# Altium project USB_CPLD.PRJPCB
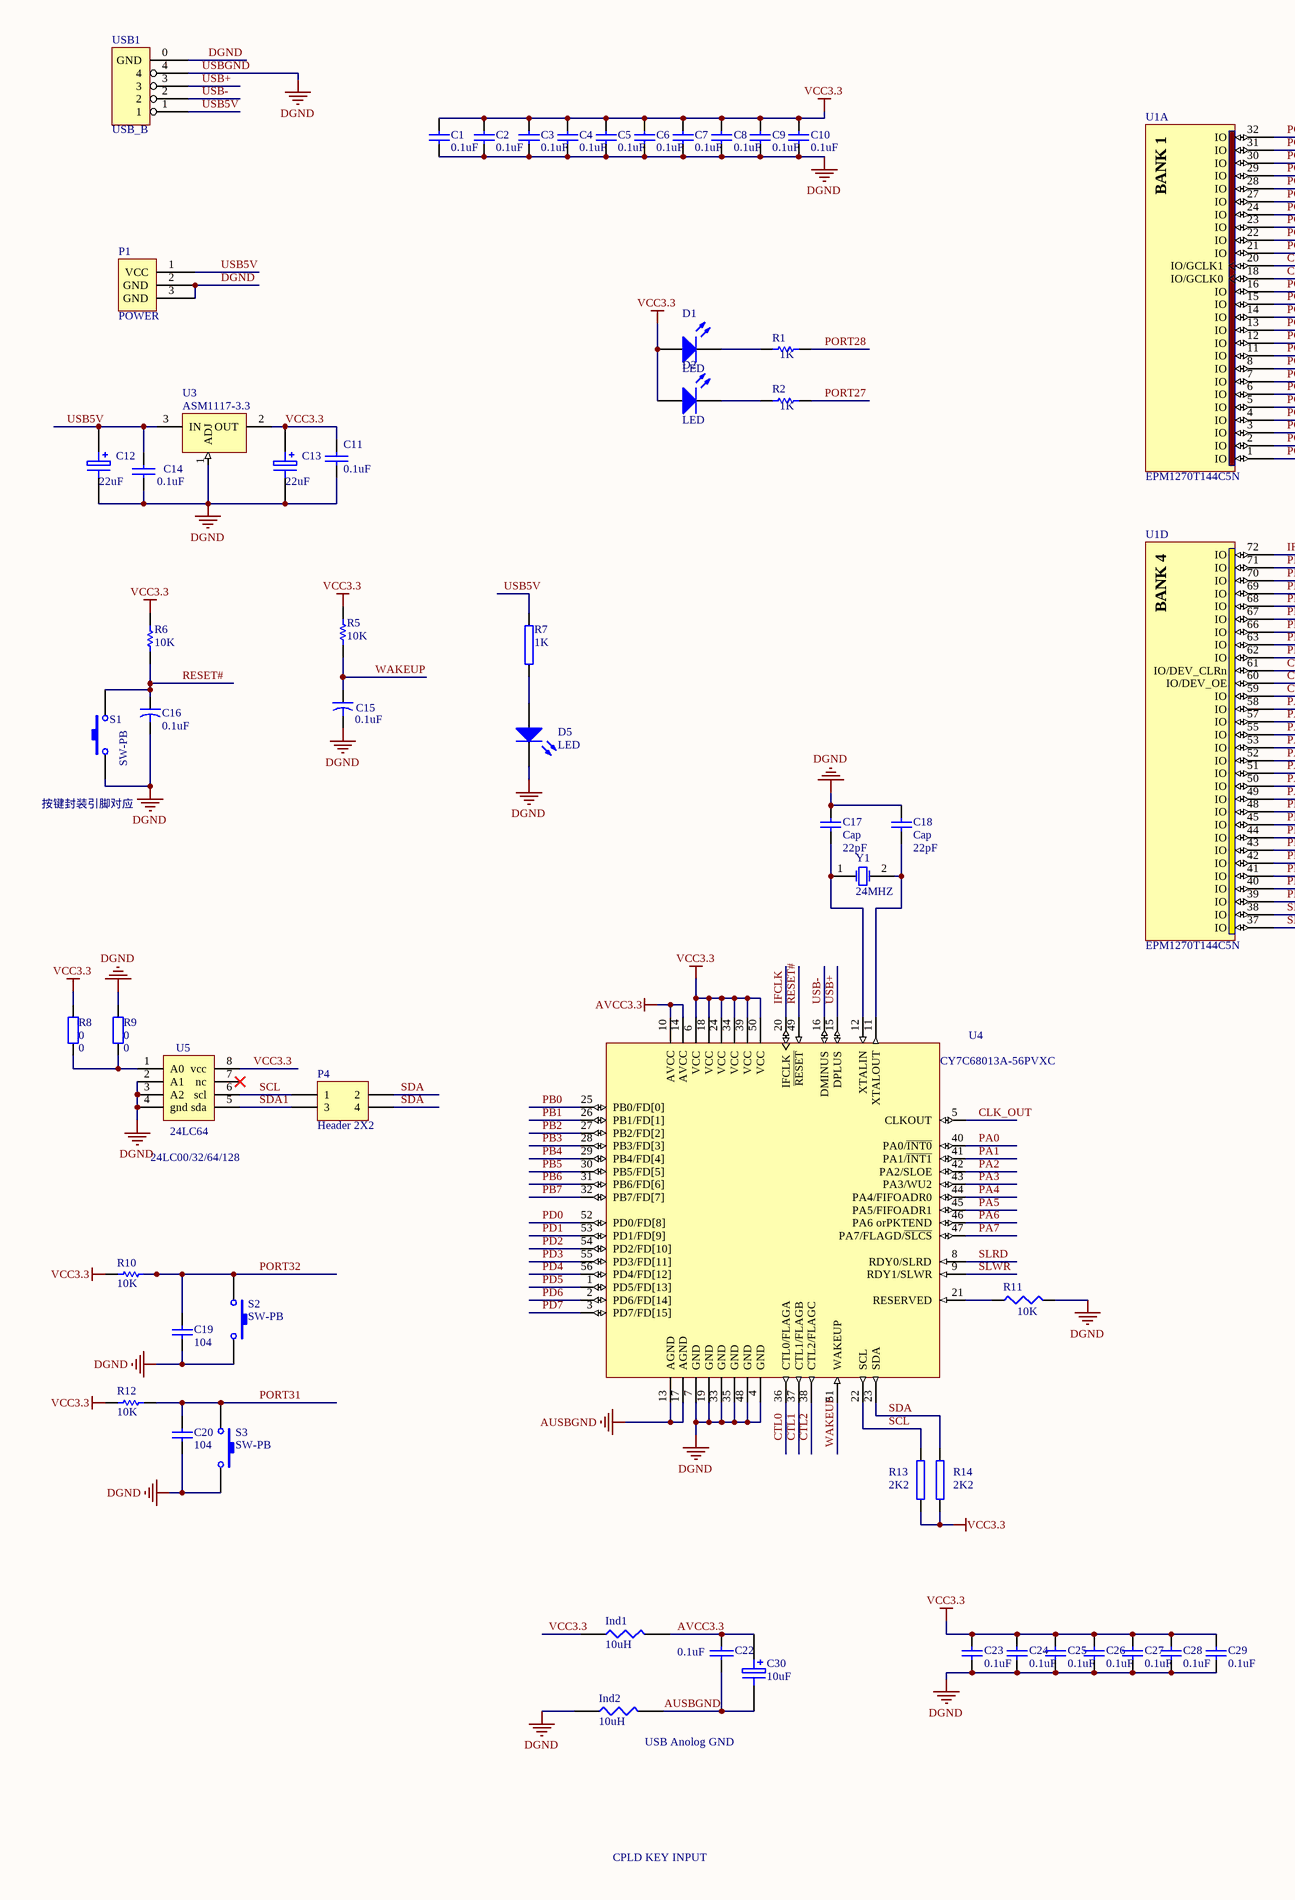
[diagram p0: USB_CPLD.SchDoc, left]
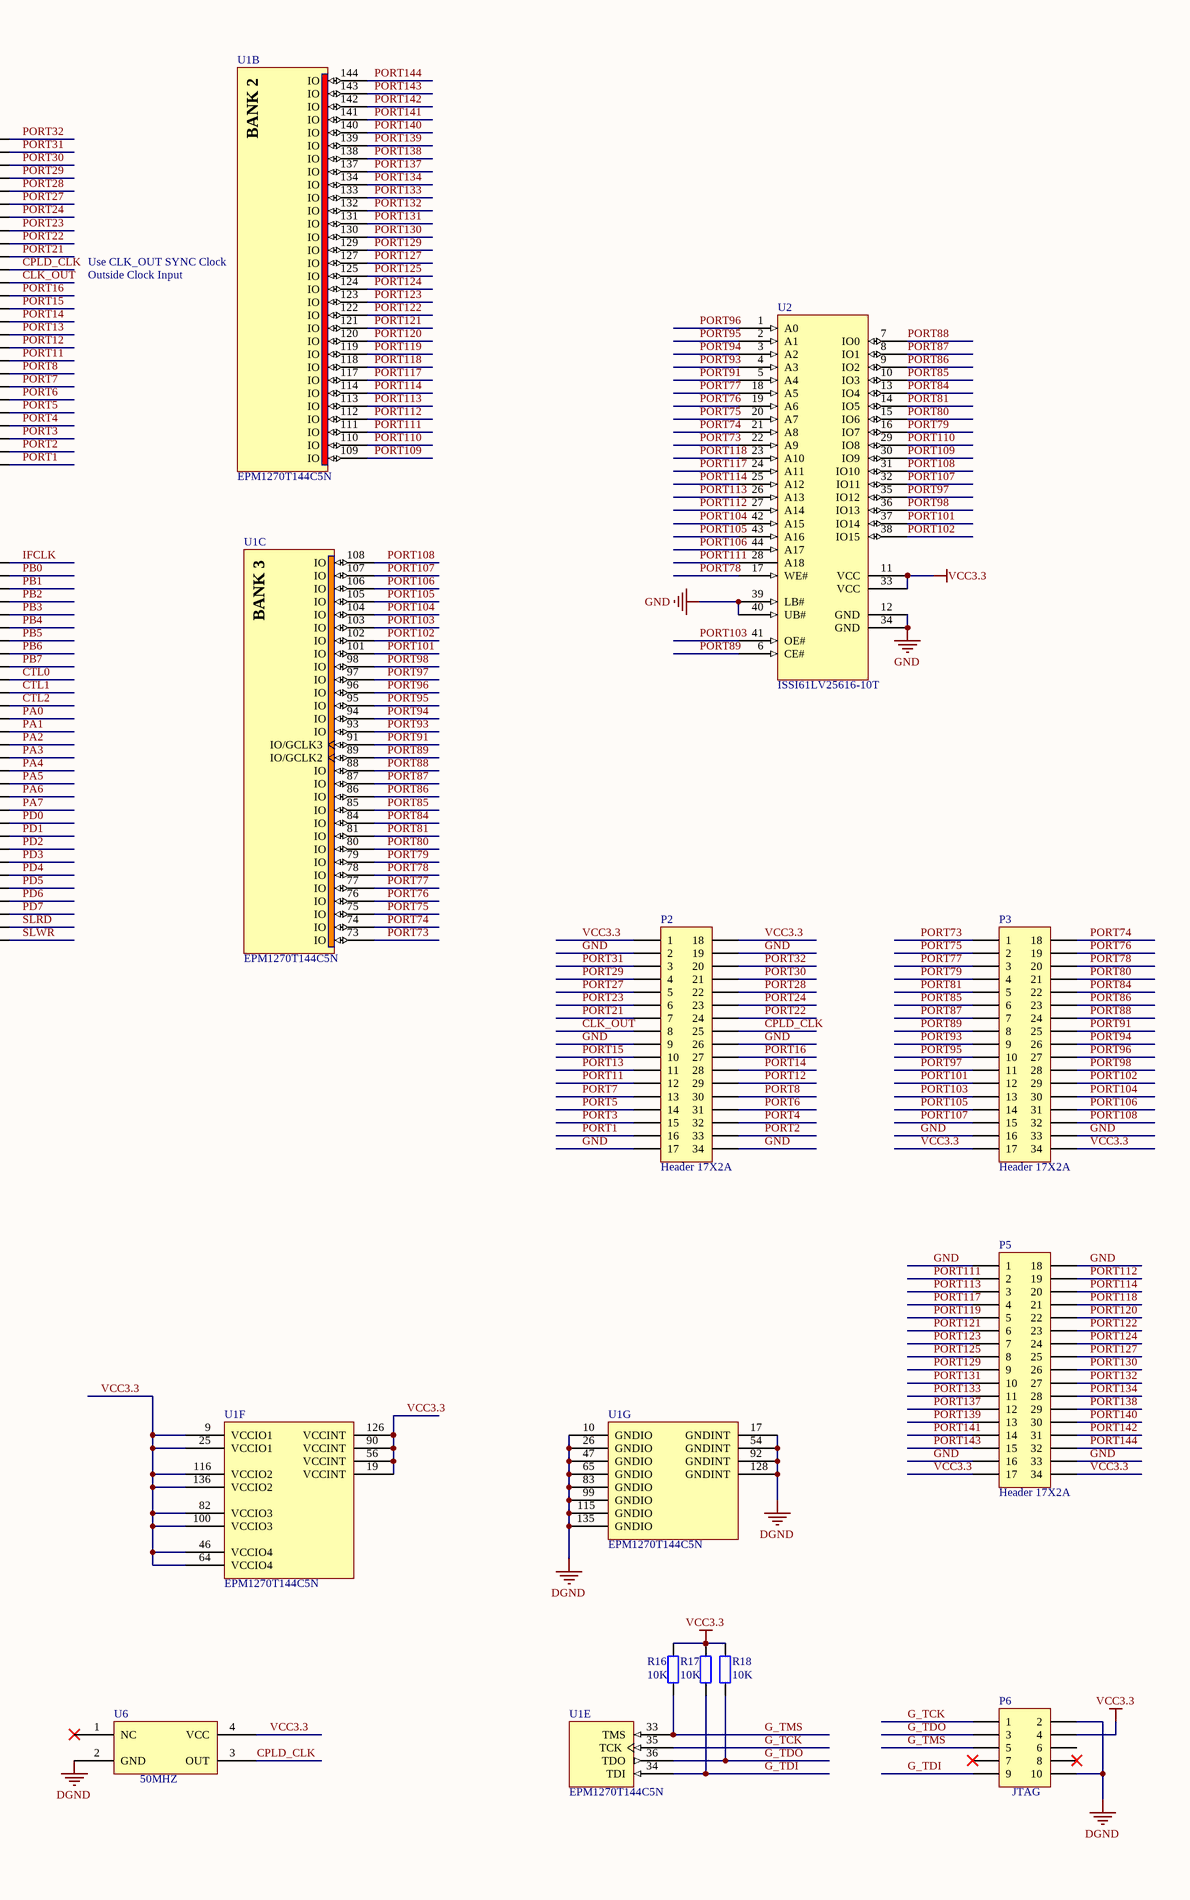
[diagram p1: USB_CPLD.SchDoc, right]
1 sheet, 66 parts. Net scope: global (net labels, ports and power ports of the same name join across sheets).
Board file: USB_CPLD.PcbDoc

## Sheet USB_CPLD.SchDoc: PC-104 16 bit bus
size C; Organization: Organization; Address1: Address1; Address2: Address2; Address3: Address3; Address4: Address4; DocumentNumber: 1; Revision: 0; SheetNumber: 2; SheetTotal: 2

### Parts
C1  0.1uF  [1608[0603]]
C2  0.1uF  [1608[0603]]
C3  value 0.1uF  [1608[0603]]  (hidden comment: Cap Semi)
C4  value 0.1uF  [1608[0603]]  (hidden comment: Cap Semi)
C5  value 0.1uF  [1608[0603]]  (hidden comment: Cap Semi)
C6  value 0.1uF  [1608[0603]]  (hidden comment: Cap Semi)
C7  value 0.1uF  [1608[0603]]  (hidden comment: Cap Semi)
C8  value 0.1uF  [1608[0603]]  (hidden comment: Cap Semi)
C9  value 0.1uF  [1608[0603]]  (hidden comment: Cap Semi)
C10  value 0.1uF  [1608[0603]]  (hidden comment: Cap Semi)
C11  0.1uF  [1608[0603]]
C12  22uF  [3528]
C13  22uF  [3528]
C14  0.1uF  [1608[0603]]
C15  0.1uF  [1206]
C16  0.1uF  [1206]
C17  Cap  value 22pF  [1608[0603]]
C18  Cap  value 22pF  [1608[0603]]
C19  104  [1608[0603]]
C20  104  [1608[0603]]
C22  0.1uF  [1608[0603]]
C23  value 0.1uF  [1608[0603]]  (hidden comment: Cap Semi)
C24  value 0.1uF  [1608[0603]]  (hidden comment: Cap Semi)
C25  value 0.1uF  [1608[0603]]  (hidden comment: Cap Semi)
C26  value 0.1uF  [1608[0603]]  (hidden comment: Cap Semi)
C27  value 0.1uF  [1608[0603]]  (hidden comment: Cap Semi)
C28  value 0.1uF  [1608[0603]]  (hidden comment: Cap Semi)
C29  value 0.1uF  [1608[0603]]  (hidden comment: Cap Semi)
C30  10uF  [1206]
D1  LED  [LED-3]
D2  LED  [LED-3]
D5  LED  [LED-3]
Ind1  10uH  [0805]
Ind2  10uH  [0805]
P1  POWER  [POWER_BIG]
P2  Header 17X2A  [HDR2X17_CEN]
P3  Header 17X2A  [HDR2X17_CEN]
P4  Header 2X2  [HDR2X2]
P5  Header 17X2A  [HDR2X17_CEN]
P6  JTAG  [HDR2X5]
R1  value 1K  [1608[0603]]  (hidden comment: Res1)
R2  value 1K  [1608[0603]]  (hidden comment: Res1)
R5  10K  [1608[0603]]
R6  10K  [1608[0603]]
R7  1K  [2012[0805]]
R8  0  [1608[0603]]
R9  0  [1608[0603]]
R10  10K  [1608[0603]]
R11  value 10K  [1608[0603]]  (hidden comment: Res3)
R12  10K  [1608[0603]]
R13  2K2  [1608[0603]]
R14  2K2  [1608[0603]]
R16  value 10K  [1608[0603]]  (hidden comment: 300)
R17  value 10K  [1608[0603]]  (hidden comment: 300)
R18  value 10K  [1608[0603]]  (hidden comment: 300)
S1  SW-PB  [SW-6-6]
S2  SW-PB  [SW-6-6]
S3  SW-PB  [SW-6-6]
U1  EPM1270T144C5N  [TQFP144_N]  (parts A,B,C,D,E,F,G of 7)
U2  ISSI61LV25616-10T  [TSOPII44]
U3  ASM1117-3.3  [SOT223]
U4  CY7C68013A-56PVXC  [O56]
U5  24LC64  [SO-8]
U6  50MHZ  [OSC_50MHZ]
USB1  USB_B  [USB-SQUARE]
Y1  24MHZ  [XTAL]

### Nets
AUSBGND: C22.2 C30.2 Ind2.2 U4.13(AGND) U4.17(AGND)
AVCC3.3: C22.1 C30.1 Ind1.2 U4.10(AVCC) U4.14(AVCC)
DGND: C1.1 C2.1 C3.1 C4.1 C5.1 C6.1 C7.1 C8.1 C9.1 C10.1 C11.2 C12.2 C13.2 C14.2 C15.2 C16.2 C17.2 C18.2 C19.2 C20.2 C23.1 C24.1 C25.1 C26.1 C27.1 C28.1 C29.1 D5.1(K) Ind2.1 P1.2(GND) P1.3(GND) P6.2 P6.10 R9.2 R11.2 S1.1 S2.2 S3.2 U1.10(GNDIO) U1.17(GNDINT) U1.26(GNDIO) U1.47(GNDIO) U1.54(GNDINT) U1.65(GNDIO) U1.83(GNDIO) U1.92(GNDINT) U1.99(GNDIO) U1.115(GNDIO) U1.128(GNDINT) U1.135(GNDIO) U3.1(ADJ) U4.4(GND) U4.7(GND) U4.19(GND) U4.33(GND) U4.35(GND) U4.48(GND) U5.2(A1) U5.3(A2) U5.4(gnd) U6.2(GND) USB1.0(GND) USB1.4  [also labelled USBGND]
GND: P2.2 P2.9 P2.17 P2.19 P2.26 P2.34 P3.16 P3.33 P5.1 P5.16 P5.18 P5.33 U2.12(GND) U2.34(GND) U2.39(LB#) U2.40(UB#)
VCC3.3: C1.2 C2.2 C3.2 C4.2 C5.2 C6.2 C7.2 C8.2 C9.2 C10.2 C11.1 C13.1 C23.2 C24.2 C25.2 C26.2 C27.2 C28.2 C29.2 D1.2(A) D2.2(A) Ind1.1 P2.1 P2.18 P3.17 P3.34 P5.17 P5.34 P6.4 R5.2 R6.2 R8.2 R10.2 R12.2 R13.1 R14.1 R16.2 R17.2 R18.2 U1.9(VCCIO1) U1.19(VCCINT) U1.25(VCCIO1) U1.46(VCCIO4) U1.56(VCCINT) U1.64(VCCIO4) U1.82(VCCIO3) U1.90(VCCINT) U1.100(VCCIO3) U1.116(VCCIO2) U1.126(VCCINT) U1.136(VCCIO2) U2.11(VCC) U2.33(VCC) U3.2(OUT) U4.6(VCC) U4.18(VCC) U4.24(VCC) U4.34(VCC) U4.39(VCC) U4.50(VCC) U5.8(vcc) U6.4(VCC)
CLK_OUT: P2.8 U1.18(IO/GCLK0) U4.5(CLKOUT)
CPLD_CLK: P2.25 U1.20(IO/GCLK1) U6.3(OUT)
CTL0: U1.61(IO/DEV_CLRn) U4.36(CTL0/FLAGA)
CTL1: U1.60(IO/DEV_OE) U4.37(CTL1/FLAGB)
CTL2: U1.59(IO) U4.38(CTL2/FLAGC)
G_TCK: P6.1 U1.35(TCK)
G_TDI: P6.9 R17.1 U1.34(TDI)
G_TDO: P6.3 R18.1 U1.36(TDO)
G_TMS: P6.5 R16.1 U1.33(TMS)
IFCLK: U1.72(IO) U4.20(IFCLK)
PA0: U1.58(IO) U4.40(PA0/~{INT0})
PA1: U1.57(IO) U4.41(PA1/~{INT1})
PA2: U1.55(IO) U4.42(PA2/SLOE)
PA3: U1.53(IO) U4.43(PA3/WU2)
PA4: U1.52(IO) U4.44(PA4/FIFOADR0)
PA5: U1.51(IO) U4.45(PA5/FIFOADR1)
PA6: U1.50(IO) U4.46(PA6_orPKTEND)
PA7: U1.49(IO) U4.47(PA7/FLAGD/~{SLCS})
PB0: U1.71(IO) U4.25(PB0/FD[0])
PB1: U1.70(IO) U4.26(PB1/FD[1])
PB2: U1.69(IO) U4.27(PB2/FD[2])
PB3: U1.68(IO) U4.28(PB3/FD[3])
PB4: U1.67(IO) U4.29(PB4/FD[4])
PB5: U1.66(IO) U4.30(PB5/FD[5])
PB6: U1.63(IO) U4.31(PB6/FD[6])
PB7: U1.62(IO) U4.32(PB7/FD[7])
PD0: U1.48(IO) U4.52(PD0/FD[8])
PD1: U1.45(IO) U4.53(PD1/FD[9])
PD2: U1.44(IO) U4.54(PD2/FD[10])
PD3: U1.43(IO) U4.55(PD3/FD[11])
PD4: U1.42(IO) U4.56(PD4/FD[12])
PD5: U1.41(IO) U4.1(PD5/FD[13])
PD6: U1.40(IO) U4.2(PD6/FD[14])
PD7: U1.39(IO) U4.3(PD7/FD[15])
PORT1: P2.16 U1.1(IO)
PORT2: P2.33 U1.2(IO)
PORT3: P2.15 U1.3(IO)
PORT4: P2.32 U1.4(IO)
PORT5: P2.14 U1.5(IO)
PORT6: P2.31 U1.6(IO)
PORT7: P2.13 U1.7(IO)
PORT8: P2.30 U1.8(IO)
PORT11: P2.12 U1.11(IO)
PORT12: P2.29 U1.12(IO)
PORT13: P2.11 U1.13(IO)
PORT14: P2.28 U1.14(IO)
PORT15: P2.10 U1.15(IO)
PORT16: P2.27 U1.16(IO)
PORT21: P2.7 U1.21(IO)
PORT22: P2.24 U1.22(IO)
PORT23: P2.6 U1.23(IO)
PORT24: P2.23 U1.24(IO)
PORT27: P2.5 R2.2 U1.27(IO)
PORT28: P2.22 R1.2 U1.28(IO)
PORT29: P2.4 U1.29(IO)
PORT30: P2.21 U1.30(IO)
PORT31: C20.1 P2.3 R12.1 S3.1 U1.31(IO)
PORT32: C19.1 P2.20 R10.1 S2.1 U1.32(IO)
PORT73: P3.1 U1.73(IO) U2.22(A9)
PORT74: P3.18 U1.74(IO) U2.21(A8)
PORT75: P3.2 U1.75(IO) U2.20(A7)
PORT76: P3.19 U1.76(IO) U2.19(A6)
PORT77: P3.3 U1.77(IO) U2.18(A5)
PORT78: P3.20 U1.78(IO) U2.17(WE#)
PORT79: P3.4 U1.79(IO) U2.16(IO7)
PORT80: P3.21 U1.80(IO) U2.15(IO6)
PORT81: P3.5 U1.81(IO) U2.14(IO5)
PORT84: P3.22 U1.84(IO) U2.13(IO4)
PORT85: P3.6 U1.85(IO) U2.10(IO3)
PORT86: P3.23 U1.86(IO) U2.9(IO2)
PORT87: P3.7 U1.87(IO) U2.8(IO1)
PORT88: P3.24 U1.88(IO) U2.7(IO0)
PORT89: P3.8 U1.89(IO/GCLK2) U2.6(CE#)
PORT91: P3.25 U1.91(IO/GCLK3) U2.5(A4)
PORT93: P3.9 U1.93(IO) U2.4(A3)
PORT94: P3.26 U1.94(IO) U2.3(A2)
PORT95: P3.10 U1.95(IO) U2.2(A1)
PORT96: P3.27 U1.96(IO) U2.1(A0)
PORT97: P3.11 U1.97(IO) U2.35(IO12)
PORT98: P3.28 U1.98(IO) U2.36(IO13)
PORT101: P3.12 U1.101(IO) U2.37(IO14)
PORT102: P3.29 U1.102(IO) U2.38(IO15)
PORT103: P3.13 U1.103(IO) U2.41(OE#)
PORT104: P3.30 U1.104(IO) U2.42(A15)
PORT105: P3.14 U1.105(IO) U2.43(A16)
PORT106: P3.31 U1.106(IO) U2.44(A17)
PORT107: P3.15 U1.107(IO) U2.32(IO11)
PORT108: P3.32 U1.108(IO) U2.31(IO10)
PORT109: U1.109(IO) U2.30(IO9)
PORT110: U1.110(IO) U2.29(IO8)
PORT111: P5.2 U1.111(IO) U2.28(A18)
PORT112: P5.19 U1.112(IO) U2.27(A14)
PORT113: P5.3 U1.113(IO) U2.26(A13)
PORT114: P5.20 U1.114(IO) U2.25(A12)
PORT117: P5.4 U1.117(IO) U2.24(A11)
PORT118: P5.21 U1.118(IO) U2.23(A10)
PORT119: P5.5 U1.119(IO)
PORT120: P5.22 U1.120(IO)
PORT121: P5.6 U1.121(IO)
PORT122: P5.23 U1.122(IO)
PORT123: P5.7 U1.123(IO)
PORT124: P5.24 U1.124(IO)
PORT125: P5.8 U1.125(IO)
PORT127: P5.25 U1.127(IO)
PORT129: P5.9 U1.129(IO)
PORT130: P5.26 U1.130(IO)
PORT131: P5.10 U1.131(IO)
PORT132: P5.27 U1.132(IO)
PORT133: P5.11 U1.133(IO)
PORT134: P5.28 U1.134(IO)
PORT137: P5.12 U1.137(IO)
PORT138: P5.29 U1.138(IO)
PORT139: P5.13 U1.139(IO)
PORT140: P5.30 U1.140(IO)
PORT141: P5.14 U1.141(IO)
PORT142: P5.31 U1.142(IO)
PORT143: P5.15 U1.143(IO)
PORT144: P5.32 U1.144(IO)
RESET#: C16.1 R6.1 S1.2 U4.49(~{RESET})
SCL: P4.1 R13.2 U4.22(SCL) U5.6(scl)
SDA: P4.2 P4.4 R14.2 U4.23(SDA)
SDA1: P4.3 U5.5(sda)
SLRD: U1.38(IO) U4.8(RDY0/SLRD)
SLWR: U1.37(IO) U4.9(RDY1/SLWR)
USB5V: C12.1 C14.1 P1.1(VCC) R7.2 U3.3(IN) USB1.1
USB+: U4.15(DPLUS) USB1.3
USB-: U4.16(DMINUS) USB1.2
WAKEUP: C15.1 R5.1 U4.51(WAKEUP)
NetC17_1: C17.1 U4.12(XTALIN) Y1.1(OSC1)
NetC18_1: C18.1 U4.11(XTALOUT) Y1.2(OSC2)
NetD1_1: D1.1(K) R1.1
NetD2_1: D2.1(K) R2.1
NetD5_2: D5.2(A) R7.1
NetR8_1: R8.1 R9.1 U5.1(A0)
NetR11_1: R11.1 U4.21(RESERVED)

Not connected (* = marked no-connect by the designer): P6 6 7* 8*; U5 7(nc)*; U6 1(NC)*

### Notes on the sheet
- Use CLK_OUT SYNC Clock
- Outside Clock Input
- (near S1) 按键封装引脚对应
- (near U5) 24LC00/32/64/128
- (near Ind2) USB Anolog GND
- CPLD KEY INPUT
- (in symbol EPM1270T144C5N, part A) BANK 1
- (in symbol EPM1270T144C5N, part B) BANK 2
- (in symbol EPM1270T144C5N, part C) BANK 3
- (in symbol EPM1270T144C5N, part D) BANK 4

### Library data of the parts
C1-C10 C19 C20 C23-C29 = Cap Semi: Capacitor (Semiconductor SIM Model); Published: 8-Jun-2000; LatestRevisionDate: 17-Jul-2002; LatestRevisionNote: Re-released for DXP Platform.; PackageReference: C1206; Publisher: Altium Limited
  C1 C2: Value: 0.1uF
  C19 C20: Value: 104
C11 C14 C22 = CAP: Capacitor
C12 C13 C30 = ELECTRO1: Electrolytic Capacitor
C15 C16 = Cap2: Capacitor; Value: 10uF; Published: 23-Sep-2002; PackageReference: CAPR5-4X5; Publisher: Altium Limited
C17 C18 = Cap: Capacitor; Published: 8-Jun-2000; LatestRevisionDate: 17-Jul-2002; LatestRevisionNote: Re-released for DXP Platform.; PackageReference: RAD-0.3; Publisher: Altium Limited
D1 D2 D5 = LED3: Typical BLUE SiC LED; Published: 8-Jun-2000; LatestRevisionDate: 17-Dec-2003; LatestRevisionNote: PCB Footprint replaced.; DatasheetDocument: 16-Apr-2002; PackageDocument: 16-Apr-2002; PackageReference: 3.5X2.8X1.9; Publisher: Altium Limited
Ind1 Ind2 = RES1
P2 P3 P5 = Header 17X2A: Header, 17-Pin, Dual row; LatestRevisionDate: 17-Jul-2002; LatestRevisionNote: Re-released for DXP Platform.; Publisher: Altium Limited
P4 = Header 2X2: Header, 2-Pin, Dual row; LatestRevisionDate: 17-Jul-2002; LatestRevisionNote: Re-released for DXP Platform.; Publisher: Altium Limited
P6 = Header 5X2: Header, 5-Pin, Dual row; LatestRevisionDate: 17-Jul-2002; LatestRevisionNote: Re-released for DXP Platform.; Publisher: Altium Limited
R1 R2 R5 R6 R10 R12 = Res1: Resistor; Published: 8-Jun-2000; LatestRevisionDate: 17-Jul-2002; LatestRevisionNote: Re-released for DXP Platform.; PackageReference: AXIAL-0.3; Publisher: Altium Limited
  R5 R6 R10 R12: Value: 10K
R7 R13 R14 = RES2
R8 R9 R16-R18 = Res2: Resistor; Published: 8-Jun-2000; Revision: July-2002: Re-released for DXP Platform.; Publisher: Altium Limited
  R8 R9: Value: 0
R11 = Res3: Resistor; Published: 8-Jun-2000; LatestRevisionDate: 04-Mar-2005; LatestRevisionNote: PCB Footprint replaced.; PackageReference: J1-0603; Publisher: Altium Limited
S1-S3 = SW-PB: Switch; Published: 24-Mar-1999; LatestRevisionDate: 17-Jul-2002; LatestRevisionNote: Re-released for DXP Platform.; PackageReference: SPST-2; Publisher: Altium Limited
U1 = EPM1270T144C5N: MAX II 3.3/2.5V CPLD, 116 IOs, 1,270 Logic Elements, 144-Pin Plastic TQFP, Commercial Temperature, Speed Grade 5, Pb-Free; Note: Each set of VCCIO pins can be connected to 3.3V, 2.5V, 1.8V, or 1.5V.; Note: All VCCINT pins must be connected to either 3.3V or 2.5V (but not a combination of both).; Published: 4-Mar-2005; LatestRevisionDate: 13-Apr-2006; LatestRevisionNote: IPC-7351 Footprint Added.; DatasheetVersion: ver1.8, Jul-2006; PackageVersion: ver14.3, Jul-2006; PackageReference: TQFP144; Publisher: Altium Limited; PackageDescription: 144-Pin Plastic Thin Quad Flat Pack (TQFP144); Code_JEDEC: MS-026-BFB; ComponentLink1Description: Manufacturer Link; ComponentLink1URL: http://www.altera.com/products/devices/cpld/max2/mx2-index.jsp; ComponentLink2Description: Handbook; ComponentLink2URL: http://www.altera.com/literature/hb/max2/max2_mii5v1.pdf; ComponentLink3Description: Packaging Specification; ComponentLink3URL: http://www.altera.com/literature/ds/dspkg.pdf
U2 = IS61LV25616-10T: IS61LV25616-10T  10ns Speed
U3 = LM317MAT(3): Three-Terminal Adjustable Output Positive Voltage Regulator; Text Field1: Heatsink surface is connected to pin2
U4 = CY7C68013A-56PVXC: EZ-USB FX2LP USB Microcontroller Ideal for Non-Battery Powered Applications,16K RAM, 24 I/Os, 56-Pin SSOP, Pb-Free, Commercial Grade; Published: 16-Dec-2005; DatasheetVersion: rev.J, Sep-2005; PackageVersion: Feb-2005; PackageReference: O56; Publisher: Altium Limited; PackageDescription: SSOP; 56 Leads; Body Width 7.5 mm; Pitch 0.635 mm; Code_JEDEC: MO-118-AB; Code_IPC: SSO56; ComponentLink1Description: Manufacturer Link; ComponentLink1URL: http://www.cypress.com/portal/server.pt; ComponentLink2Description: Datasheet; ComponentLink2URL: http://www.cypress.com/portal/server.pt/gateway/PTARGS_0_2_1524_209_259_43/http%3B/sjapp20.mis.cypress.com%3B7001/publishedcontent/publish/design_resources/datasheets/contents/cy7c68013a_5.pdf
U5 = 24LC00
U6 = OSC50MHZ
Y1 = XTAL: Crystal Oscillator; Published: 8-Jun-2000; LatestRevisionDate: 17-Jul-2002; LatestRevisionNote: Re-released for DXP Platform.; PackageReference: R38; Publisher: Altium Limited